# Altium schematic sheet Comm.SchDoc
size Legal; SheetNumber: 5; SheetTotal: 5
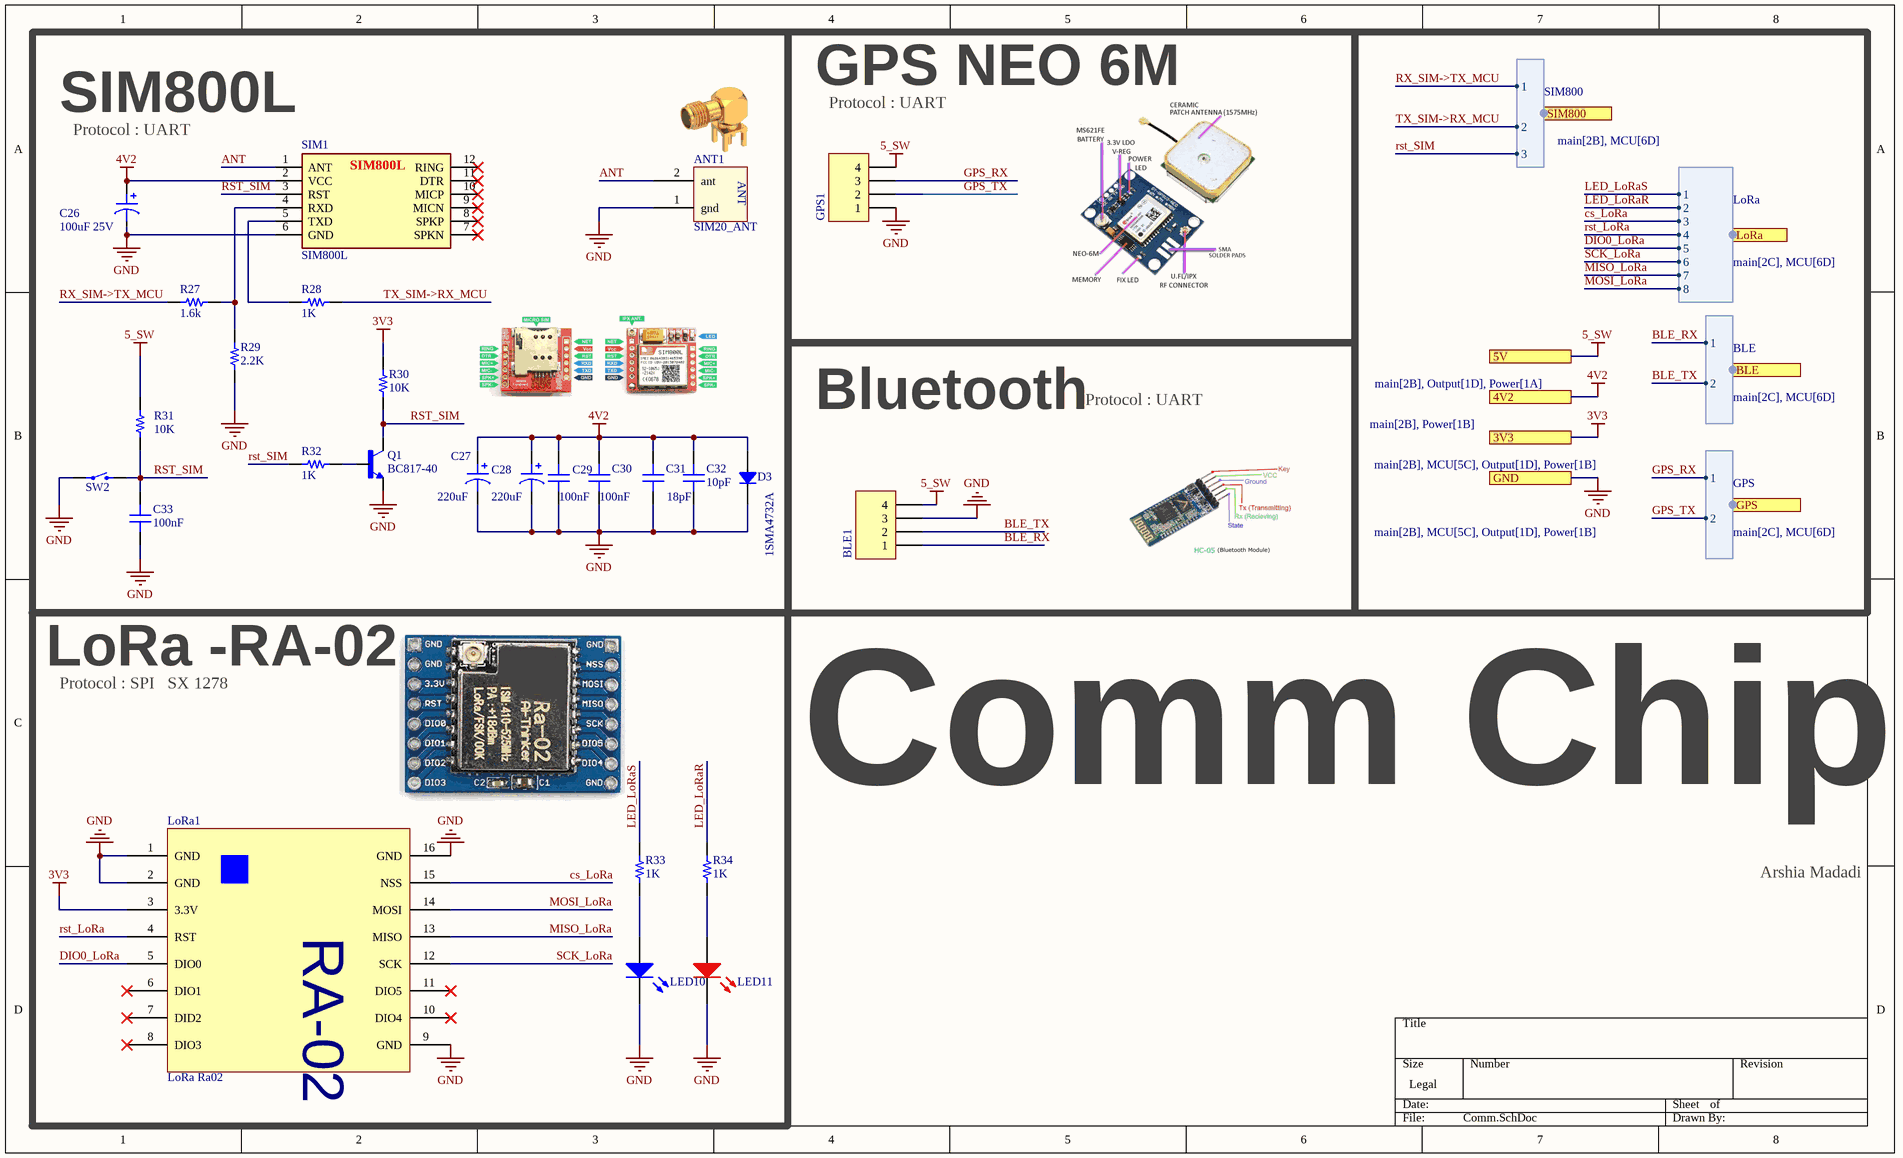
[diagram p0: Comm.SchDoc]

## Parts
ANT1  SIM20_ANT  [MY_SIM20_ANT]
BLE1  Header 4  [My_1X04]  (value not drawn)
C26  100uF 25V  [CAP ALSMD POLY 10.3MM H10.5MM]
C27  220uF  [CAP TANSMD 2312_6032 CASE C]
C28  220uF  [CAP TANSMD 2312_6032 CASE C]
C29  100nF  [CAP 0603_1608]
C30  100nF  [CAP 0603_1608]
C31  18pF  [CAP 0603_1608]
C32  10pF  [CAP 0603_1608]
C33  100nF  [CAP 0603_1608]
D3  1SMA4732A  [DO-214AC SMA]
GPS1  Header 4  [My_1X04]  (value not drawn)
LED10  LED SMD 0805 BLUE  [LED_0805_RED]  (value not drawn)
LED11  LED SMD 0805 RED  [LED_0805_RED]  (value not drawn)
LoRa1  LoRa Ra02  [LoRa - Ra-02]
Q1  BC817-40  [SOT95P237X112-3N]
R27  1.6k  [RES 0603_1608]
R28  1K  [RES 0603_1608]
R29  2.2K  [RES 0603_1608]
R30  10K  [RES 0603_1608]
R31  10K  [RES 0603_1608]
R32  1K  [RES 0603_1608]
R33  1K  [RES 0603_1608]
R34  1K  [RES 0603_1608]
SIM1  SIM800L  [SIM800L]
SW2  Tactile 2PIN 6X3.5mm H4.57mm (SMD)  [SWPBS_SPST_6X3X5]  (value not drawn)

## Blocks framed on the sheet
SIM800L: ANT1 C26-C33 D3 Q1 R27-R32 SIM1 SW2
GPS NEO 6M: GPS1
Bluetooth: BLE1
LoRa -RA-02: LED10 LED11 LoRa1 R33 R34

## Ports
3V3 (see main[2B], MCU[5C], Output[1D], Power[1B]), 4V2 (see main[2B], Power[1B]), 5V (see main[2B], Output[1D], Power[1A]), BLE (harness BLE, see main[2C], MCU[6D]), GND (see main[2B], MCU[5C], Output[1D], Power[1B]), GPS (harness GPS, see main[2C], MCU[6D]), LoRa (harness LORA, see main[2C], MCU[6D]), SIM800 (harness SIM800, see main[2B], MCU[6D])

## Harnesses
LoRa: 1, 2, 3, 4, 5, 6, 7, 8
BLE: 1, 2
GPS: 1, 2
SIM800: 1, 2, 3

## Nets
3V3: LoRa1.3(3.3V) R30.1 ; port 3V3
4V2: C26.1 C27.1 C28.1 C29.2 C30.2 C31.2 C32.2 D3.1 SIM1.2(VCC) ; port 4V2
5_SW: BLE1.4 GPS1.4 R31.2 ; port 5V
GND: ANT1.1(gnd) BLE1.3 C26.2 C27.2 C28.2 C29.1 C30.1 C31.1 C32.1 C33.1 D3.2 GPS1.1 LED10.2(K) LED11.2(K) LoRa1.1(GND) LoRa1.2(GND) LoRa1.9(GND) LoRa1.16(GND) Q1.2(E) R29.2 SIM1.6(GND) SW2.1 ; port GND
ANT: ANT1.2(ant) SIM1.1(ANT)
BLE_RX: BLE1.1 ; port BLE.1
BLE_TX: BLE1.2 ; port BLE.2
cs_LoRa: LoRa1.15(NSS) ; port LoRa.3
DIO0_LoRa: LoRa1.5(DIO0) ; port LoRa.5
GPS_RX: GPS1.3 ; port GPS.1
GPS_TX: GPS1.2 ; port GPS.2
LED_LoRaR: R34.1 ; port LoRa.2
LED_LoRaS: R33.1 ; port LoRa.1
MISO_LoRa: LoRa1.13(MISO) ; port LoRa.7
MOSI_LoRa: LoRa1.14(MOSI) ; port LoRa.8
rst_LoRa: LoRa1.4(RST) ; port LoRa.4
RST_SIM: C33.2 Q1.3(C) R30.2 R31.1 R32.2 SIM1.3(RST) SW2.2 ; port SIM800.3
RX_SIM->TX_MCU: R27.1 ; port SIM800.1
SCK_LoRa: LoRa1.12(SCK) ; port LoRa.6
TX_SIM->RX_MCU: R28.1 ; port SIM800.2
NetLED10_1: LED10.1(A) R33.2
NetLED11_1: LED11.1(A) R34.2
NetQ1_1: Q1.1(B) R32.1
NetR27_2: R27.2 R29.1 SIM1.4(RXD)
NetR28_2: R28.2 SIM1.5(TXD)

Not connected (* = marked no-connect by the designer): LoRa1 6(DIO1)* 7(DID2)* 8(DIO3)* 10(DIO4)* 11(DIO5)*; SIM1 7(SPKN)* 8(SPKP)* 9(MICN)* 10(MICP)* 11(DTR)* 12(RING)*

## Notes on the sheet
- Protocol : UART
- Protocol : SPI
- SX 1278
- Comm Chip
- Arshia Madadi
- (in symbol LoRa) RA-02

## Library data of the parts
ANT1 = SIM20_ANT: ANT
BLE1 GPS1 = Header 4: Header, 4-Pin; LatestRevisionDate: 17-Jul-2002; LatestRevisionNote: Re-released for DXP Platform.; Publisher: Altium Limited
C26 = Cap Alu SMD 10.3mm H10.5mm: SMT Aluminum Polymer Capacitor; VALUE: 10uF 6.3V
C27 C28 = Cap Tan Case C: SMT Tantalum Capacitor; VALUE: 10uF 6.3V
C29 C30 C33 = Cap 0603: SMT Capacitor; VALUE: 100nF
C31 C32 = Cap 0603: SMT Capacitor; VALUE: 100nF
D3 = US1M (SMD SMA): Diode Standard 1000V 1A Surface Mount SMA; PartNumber: US1M-13-F
LoRa1 = LoRa
Q1 = BC817-40_RFG: SOT-23, 50V, 0.5A, NPN Bipolar Transistor; MP: BC817-40 RFG; MF: Taiwan Semiconductor; Check_prices: https://www.snapeda.com/parts/BC817-40%20RFG/Taiwan+Semiconductor/view-part/?ref=eda; Price: None; Purchase-URL: https://pricing.snapeda.com/search/part/BC817-40 RFG/?ref=eda; SnapEDA_Link: https://www.snapeda.com/parts/BC817-40%20RFG/Taiwan+Semiconductor/view-part/?ref=snap; Availability: In Stock; Package: SOT-23 Taiwan Semiconductor; Value: *; ComponentLink1Description: Buy; ComponentLink1URL: https://lionelectronic.ir/products/134-BC817-40
R27-R34 = Res 0603: SMT Resistor; VALUE: 100K
SW2 = Tactile 2PIN 6X3.5mm H4.57mm (SMD): Tactile Switch SPST-NO Top Actuated Surface Mount; PartNumber: FSMSMTR-ND
SIM1 = SIM800L: Publisher: 3DFootprint.ir